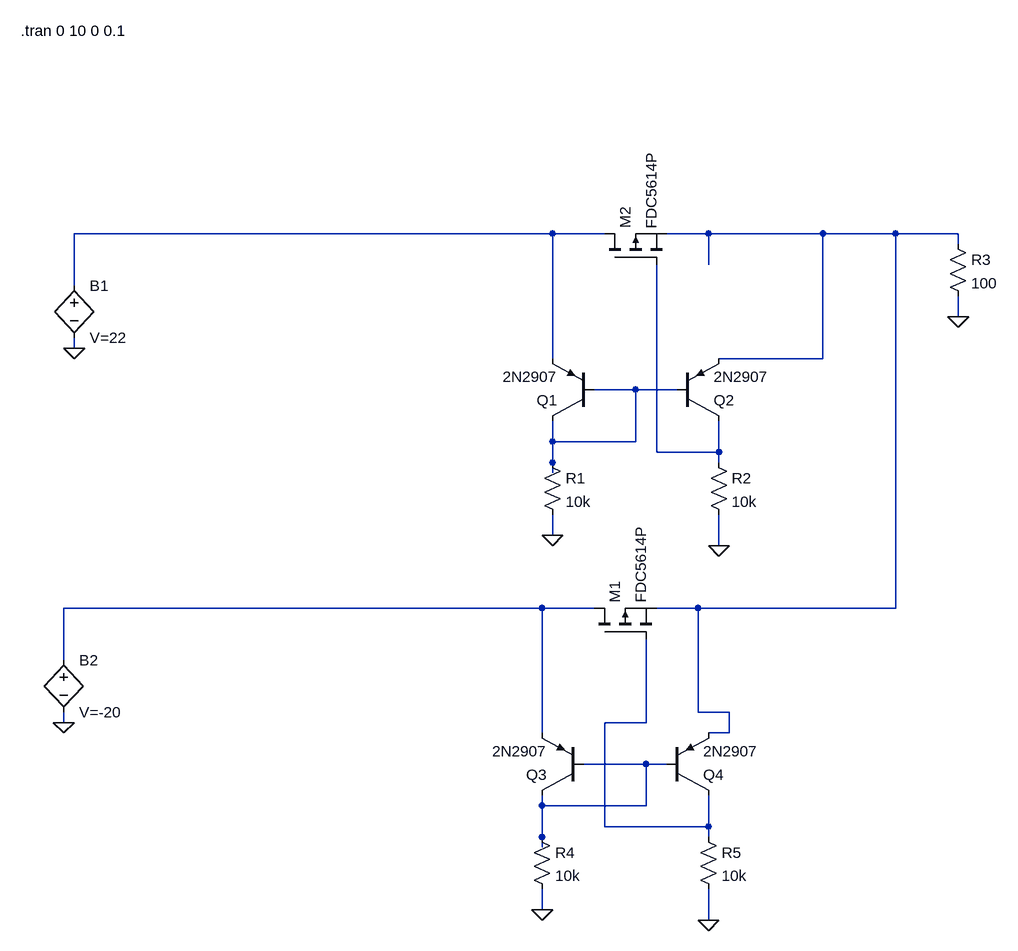
[diagram p0: schematic first.asc]
first.asc, the LTspice schematic file:
Version 4
SHEET 1 1316 1044
WIRE 624 -32 -112 -32
WIRE 704 -32 624 -32
WIRE 864 -32 800 -32
WIRE 1040 -32 864 -32
WIRE 1152 -32 1040 -32
WIRE 1248 -32 1152 -32
WIRE 1248 -16 1248 -32
WIRE 864 16 864 -32
WIRE -112 48 -112 -32
WIRE 1248 96 1248 64
WIRE -112 144 -112 128
WIRE 624 160 624 -32
WIRE 1040 160 1040 -32
WIRE 1040 160 880 160
WIRE 752 208 688 208
WIRE 816 208 752 208
WIRE 624 288 624 256
WIRE 752 288 752 208
WIRE 752 288 624 288
WIRE 784 304 784 16
WIRE 880 304 880 256
WIRE 880 304 784 304
WIRE 624 320 624 288
WIRE 880 320 880 304
WIRE 624 336 624 320
WIRE 624 432 624 400
WIRE 880 448 880 400
WIRE 608 544 -128 544
WIRE 688 544 608 544
WIRE 848 544 784 544
WIRE 1152 544 1152 -32
WIRE 1152 544 848 544
WIRE -128 624 -128 544
WIRE 848 704 848 544
WIRE 896 704 848 704
WIRE -128 720 -128 704
WIRE 768 720 768 592
WIRE 768 720 704 720
WIRE 608 736 608 544
WIRE 896 736 896 704
WIRE 896 736 864 736
WIRE 768 784 672 784
WIRE 800 784 768 784
WIRE 608 848 608 832
WIRE 768 848 768 784
WIRE 768 848 608 848
WIRE 704 880 704 720
WIRE 864 880 864 832
WIRE 864 880 704 880
WIRE 608 896 608 848
WIRE 864 896 864 880
WIRE 608 912 608 896
WIRE 608 1008 608 976
WIRE 864 1024 864 976
FLAG -112 144 0
FLAG 624 432 0
FLAG 880 448 0
FLAG 1248 96 0
FLAG -128 720 0
FLAG 608 1008 0
FLAG 864 1024 0
SYMBOL bv -112 32 R0
SYMATTR InstName B1
SYMATTR Value V=22
SYMBOL pnp 688 256 R180
SYMATTR InstName Q1
SYMATTR Value 2N2907
SYMBOL pnp 816 256 M180
SYMATTR InstName Q2
SYMATTR Value 2N2907
SYMBOL pmos 704 16 R270
SYMATTR InstName M2
SYMATTR Value FDC5614P
SYMBOL res 608 304 R0
SYMATTR InstName R1
SYMATTR Value 10k
SYMBOL res 864 304 R0
SYMATTR InstName R2
SYMATTR Value 10k
SYMBOL res 1232 -32 R0
SYMATTR InstName R3
SYMATTR Value 100
SYMBOL bv -128 608 R0
SYMATTR InstName B2
SYMATTR Value V=-20
SYMBOL pnp 672 832 R180
SYMATTR InstName Q3
SYMATTR Value 2N2907
SYMBOL pnp 800 832 M180
SYMATTR InstName Q4
SYMATTR Value 2N2907
SYMBOL pmos 688 592 R270
SYMATTR InstName M1
SYMATTR Value FDC5614P
SYMBOL res 592 880 R0
SYMATTR InstName R4
SYMATTR Value 10k
SYMBOL res 848 880 R0
SYMATTR InstName R5
SYMATTR Value 10k
TEXT -194 -344 Left 2 !.tran 0 10 0 0.1

The netlist it stands for:
* first.asc
B1 N001 0 V=22
Q1 N003 N003 N001 0 2N2907
Q2 N004 N003 N002 0 2N2907
M2 N001 N004 N002 N002 FDC5614P
R1 N003 0 10k
R2 N004 0 10k
R3 N002 0 100
B2 N005 0 V=-20
Q3 N007 N007 N005 0 2N2907
Q4 N006 N007 N002 0 2N2907
M1 N005 N006 N002 N002 FDC5614P
R4 N007 0 10k
R5 N006 0 10k
.model NPN NPN
.model PNP PNP
.lib standard.bjt
.model NMOS NMOS
.model PMOS PMOS
.lib standard.mos
.tran 0 10 0 0.1
.backanno
.end